# EAGLE design PowerSupplySimple (EAGLE 7.7.0)
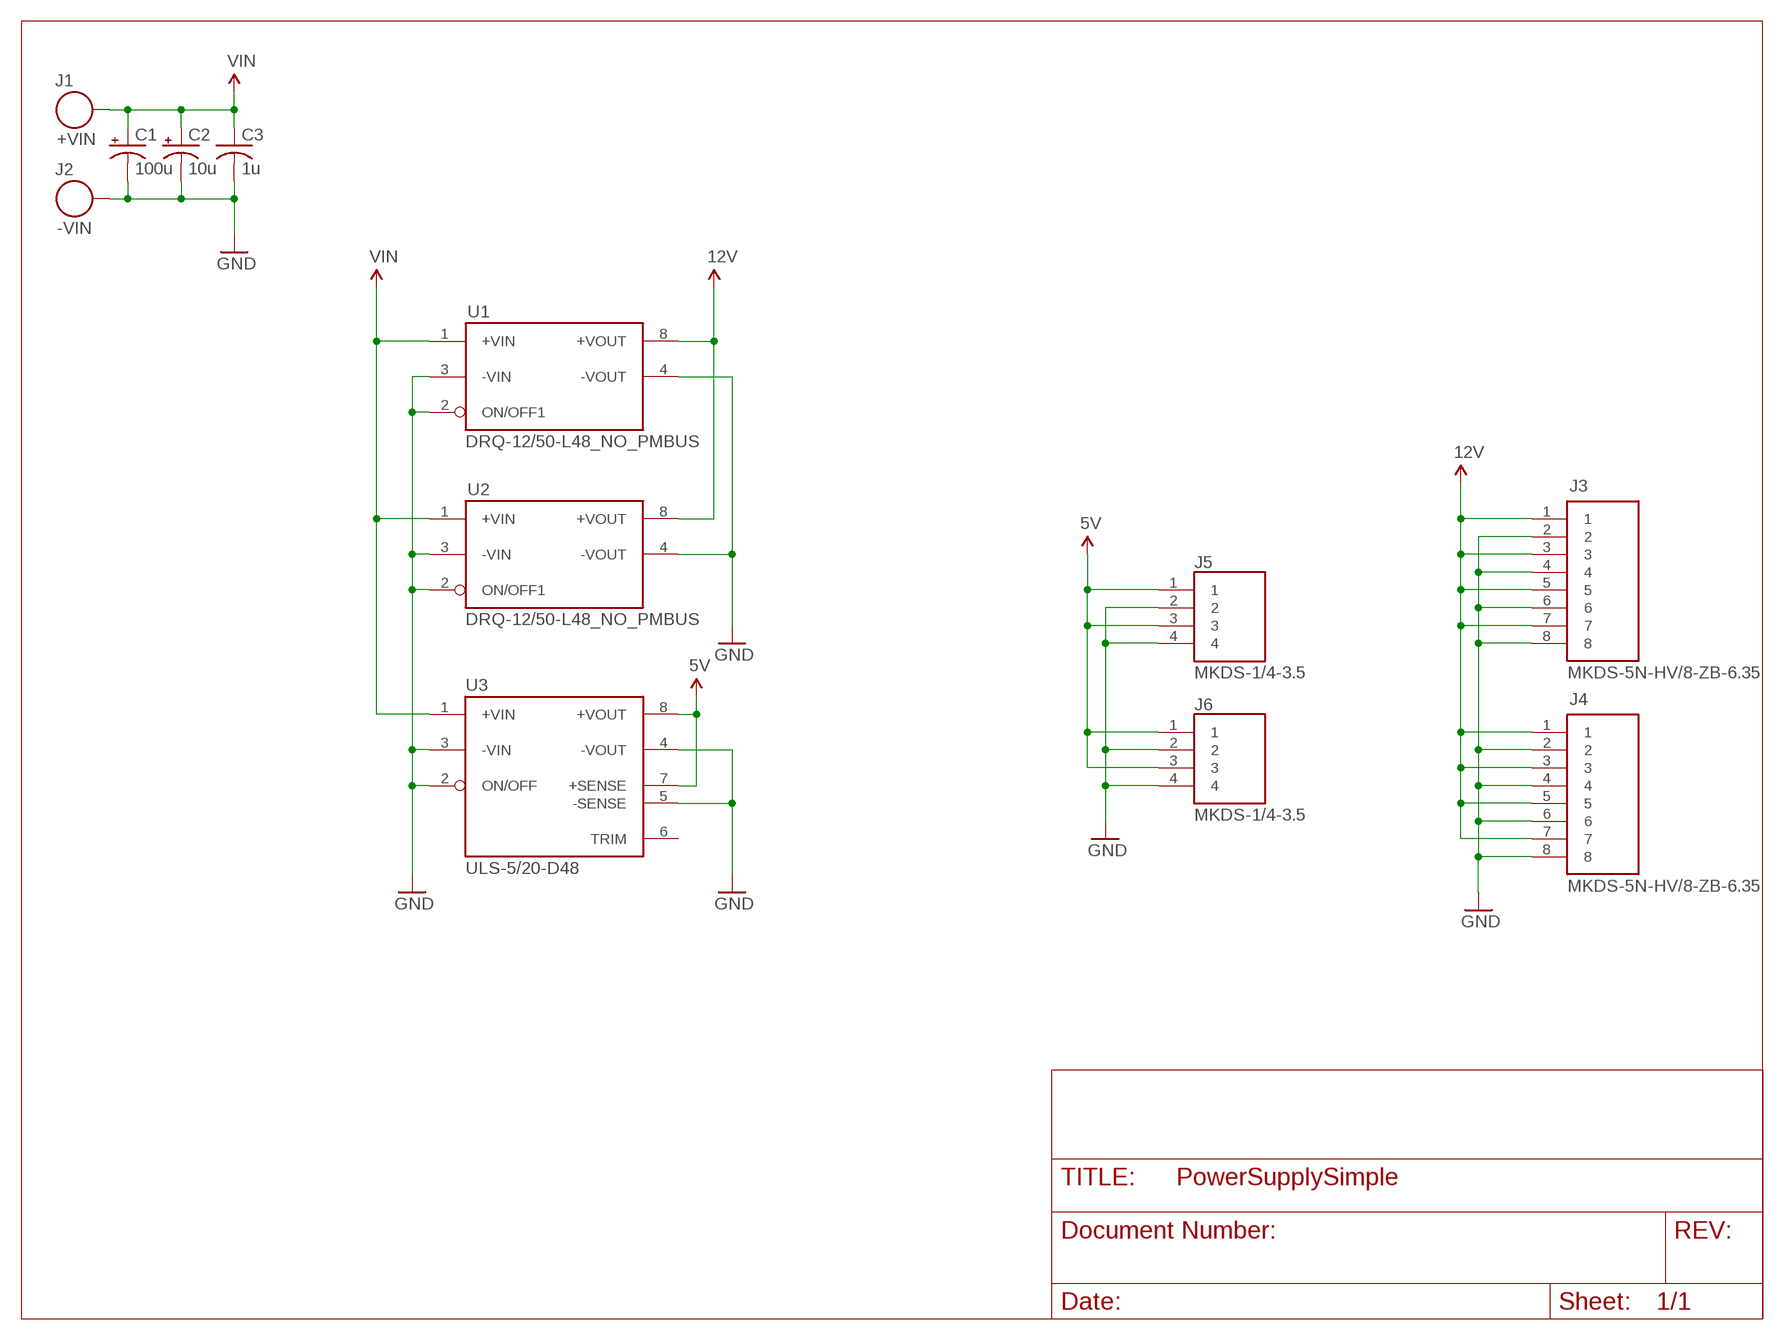
[diagram p0: schematic, sheet 1]

## Parts
C1  100u  CPOL-USE  [PANASONIC_E]
C2  10u  CPOL-USE  [PANASONIC_E]
C3  1u  C-USC0603  [C0603]
J1  +VIN  SINGLE_PIN  [10AWG]
J2  -VIN  SINGLE_PIN  [10AWG]
J3  MKDS-5N-HV/8-ZB-6.35  [1777600]
J4  MKDS-5N-HV/8-ZB-6.35  [1777600]
J5  MKDS-1/4-3.5  [1751264]
J6  MKDS-1/4-3.5  [1751264]
U1  DRQ-12/50-L48_NO_PMBUS  [DRQ(NO_PMBUS)]
U2  DRQ-12/50-L48_NO_PMBUS  [DRQ(NO_PMBUS)]
U3  ULS-5/20-D48  [1/16_BRICK_THROUGH_HOLE]

## Nets
5V: J5.1 J5.3 J6.1 J6.3 U3.7(+SENSE) U3.8(+VOUT)
12V: J3.1 J3.3 J3.5 J3.7 J4.1 J4.3 J4.5 J4.7 U1.8(+VOUT) U2.8(+VOUT)
GND: C1.- C2.- C3.2 J2.P$1 J3.2 J3.4 J3.6 J3.8 J4.2 J4.4 J4.6 J4.8 J5.2 J5.4 J6.2 J6.4 U1.2(ON/OFF1) U1.3(-VIN) U1.4(-VOUT) U2.2(ON/OFF1) U2.3(-VIN) U2.4(-VOUT) U3.2(ON/OFF) U3.3(-VIN) U3.4(-VOUT) U3.5(-SENSE)
VIN: C1.+ C2.+ C3.1 J1.P$1 U1.1(+VIN) U2.1(+VIN) U3.1(+VIN)
Unconnected: U3.6(TRIM)

## Library data of the parts
C1 C2 = resistor:CPOL-US: POLARIZED CAPACITOR, American symbol
C3 = resistor:C-US: CAPACITOR, American symbol
J1 J2 = PowerSupply:SINGLE_PIN
J3 J4 = PowerSupply:MKDS-5N-HV/8-ZB-6.35
J5 J6 = PowerSupply:MKDS-1/4-3.5
U1 U2 = PowerSupply:DRQ-12/50-L48_NO_PMBUS
U3 = PowerSupply:ULS-5/20-D48

## Board
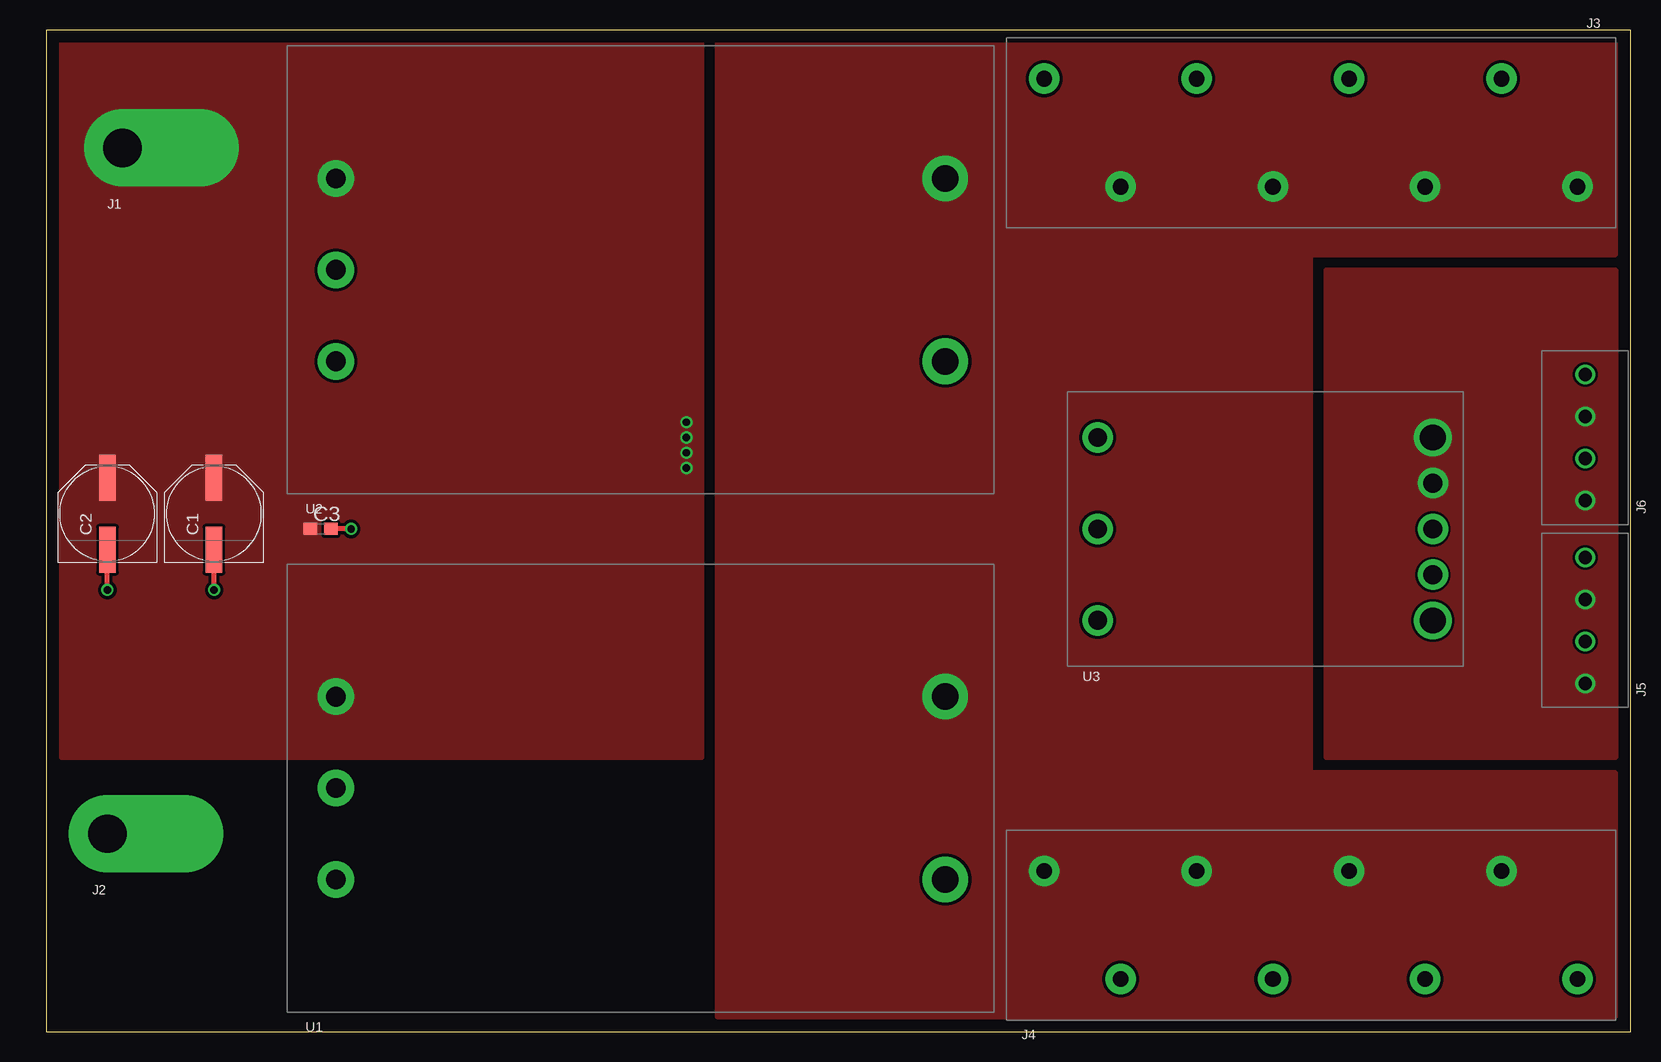
[diagram p1: board, top side]
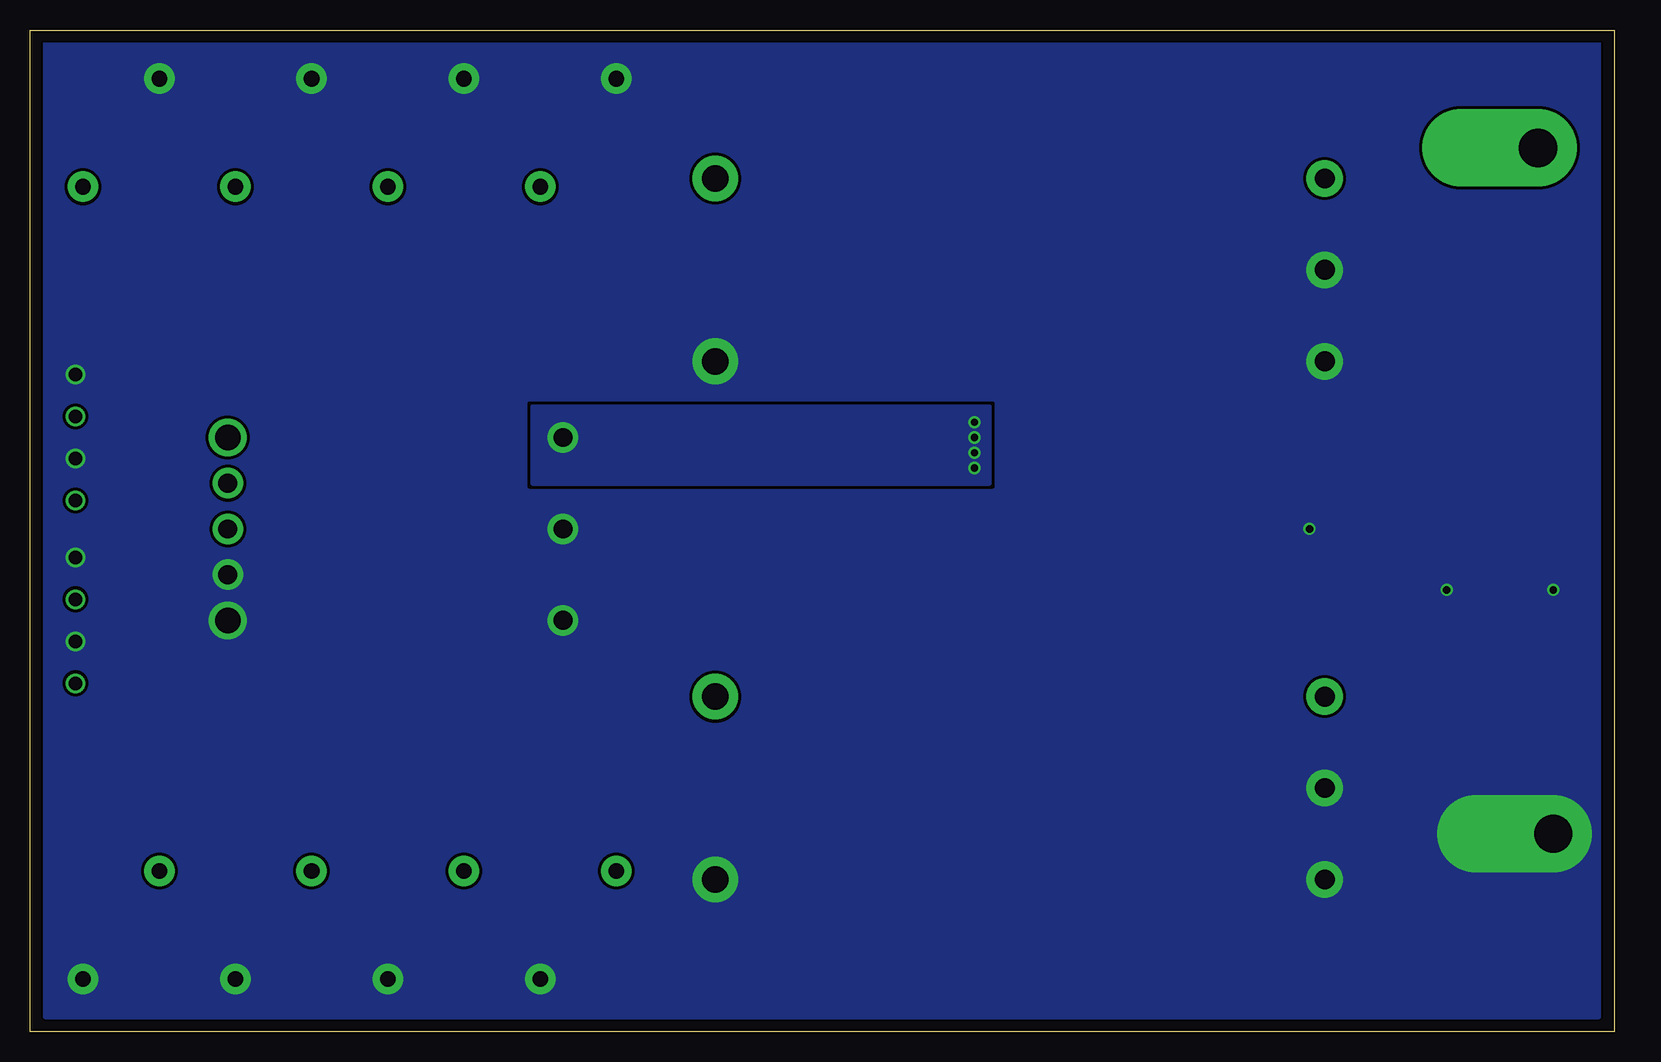
[diagram p2: board, bottom side, seen from below]

Size 132.06 x 83.49 mm. Coordinates in mm from the lower left corner, seen from the top.
Outline: 0,0 132.06,0 132.06,83.49 0,83.49 0,0
Copper layers (1*16): Top 0.035mm / dielectric 1.5mm / Bottom 0.035mm
Design rules "default": minimum track width 10mil, minimum drill 24mil, track to track 8mil, track to pad 8mil, pad to pad 8mil, via to via 8mil, smd to smd 8mil, copper to edge 40mil, drill to drill 8mil, minimum pad ring 10mil, minimum via ring 8mil, stop-mask expansion 4mil, vias tented up to drill 0mil, thermal gap 10mil

### Footprints (pad centres in the part's own frame; a part is rotated, then mirrored left to right if it is on the bottom)
PANASONIC_E = smd 3.8 x 1.4: + 3,0; - -3,0
C0603 = smd 1.1 x 1: 1 -0.85,0; 2 0.85,0
10AWG = drill 3.2 pad 6.452 offset: P$1 0,0
1777600 = drill 1.3 pad 2.54: 1 -22.225,4.5; 2 -15.875,-4.5; 3 -9.525,4.5; 4 -3.175,-4.5; 5 3.175,4.5; 6 9.525,-4.5; 7 15.875,4.5; 8 22.225,-4.5
1751264 = drill 1.1: 1 -5.25,0; 2 -1.75,0; 3 1.75,0; 4 5.25,0
DRQ(NO_PMBUS) = drill 1.651 pad 3.048: 1 -25.4,7.62; 2 -25.4,0; 3 -25.4,-7.62 | drill 2.21 pad 3.81: 4 25.4,-7.62; 8 25.4,7.62
1/16_BRICK_THROUGH_HOLE = drill 1.575 pad 2.54: 1 -13.97,7.62; 2 -13.97,0; 3 -13.97,-7.62; 5 13.97,-3.81; 6 13.97,0; 7 13.97,3.81 | drill 2.134: 4 13.97,-7.62; 8 13.97,7.62

### Placement (x,y rotation side)
C1  13.97,43.18 90 top
C2  5.08,43.18 90 top
C3  22.86,41.91 0 top
J1  6.35,73.66 0 top
J2  5.08,16.51 0 top
J3  105.41,74.93 180 top
J4  105.41,8.89 0 top
J5  128.27,34.29 90 top
J6  128.27,49.53 90 top
U1  49.53,20.32 0 top
U2  49.53,63.5 0 top
U3  101.6,41.91 0 top

### Tracks (layer width: path | path; a pad name or v marks a point on that pad's centre or on a via)
5V
  pour Top (no thermals): 106.68,63.5 130.81,63.5 130.81,26.67 130.81,22.86 106.68,22.86
12V
  pour Top (isolate 0.254, no thermals): 130.81,82.55 55.88,82.55 55.88,1.27 130.81,1.27 130.81,21.59 105.41,21.59 105.41,64.77 130.81,64.77
GND  (via drill 0.6)
  Top 0.406: v5.08,36.83 C2.- | v13.97,36.83 C1.- | v25.4,41.91 C3.2
  pour Bottom (isolate 0.254, rank 2, no thermals): 1.27,82.55 130.81,82.55 130.81,1.27 1.27,1.27
VIN  (via drill 0.6)
  other vias: 53.34,46.99 53.34,48.26 53.34,50.8 53.34,49.53
  pour Top (isolate 0.254, no thermals): 1.27,82.55 54.61,82.55 54.61,22.86 1.27,22.86
  pour Bottom (isolate 0.254, no thermals): 52.07,52.07 90.17,52.07 90.17,45.72 52.07,45.72